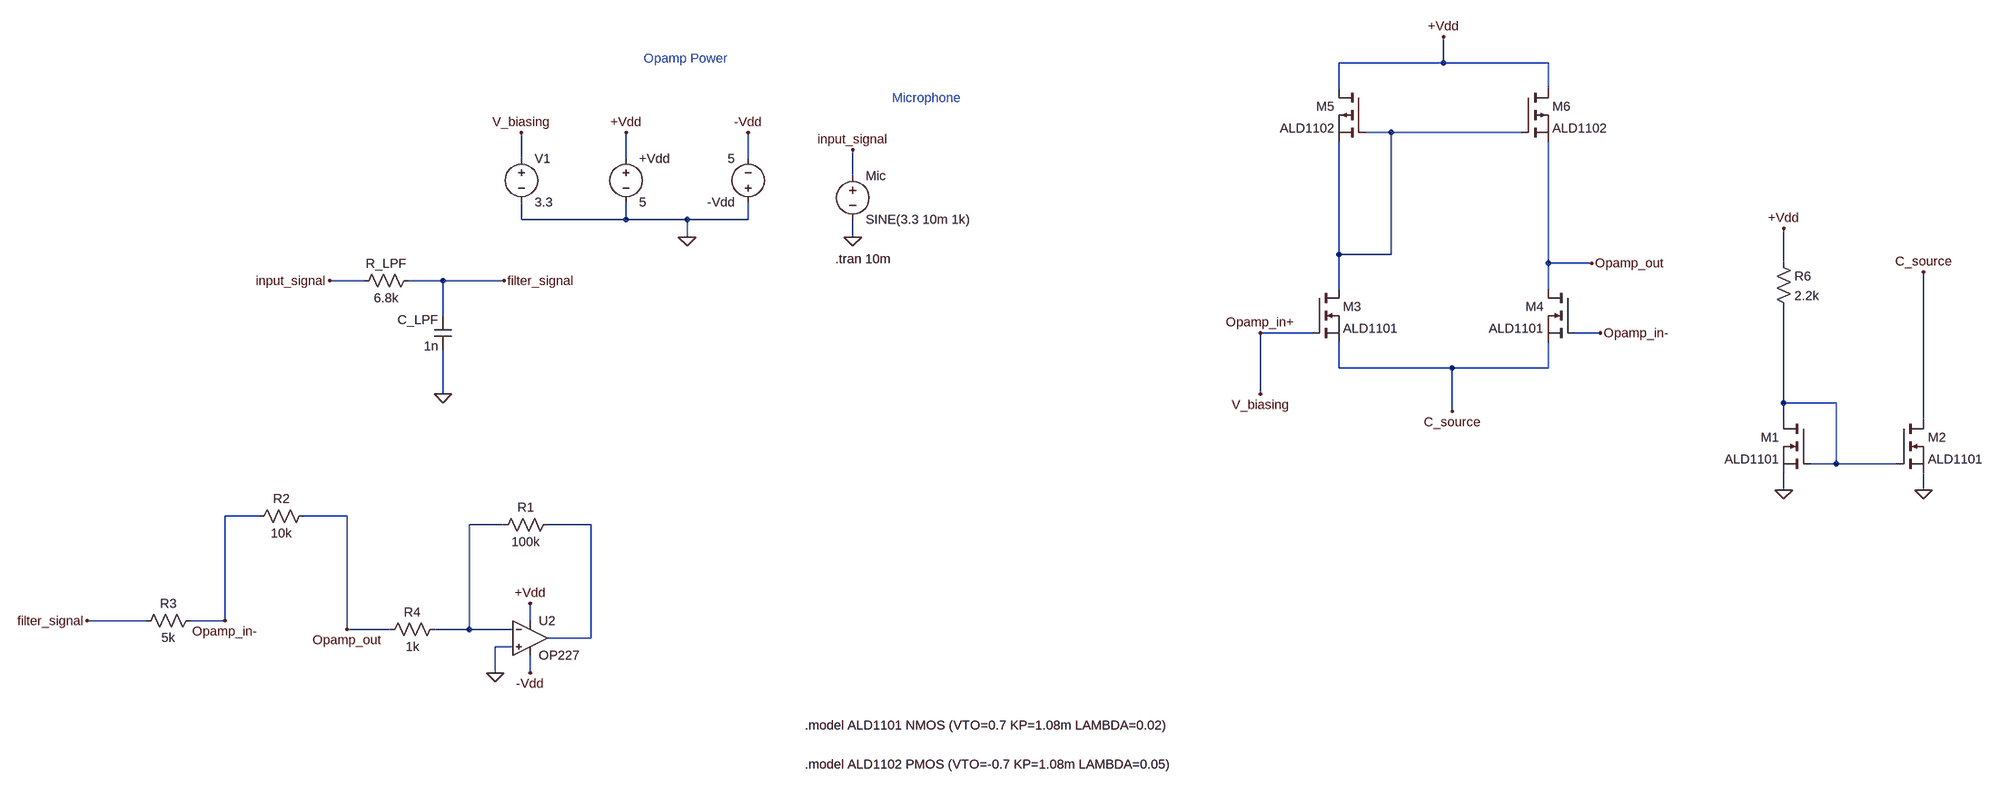
[diagram p0: schematic FinalProject_v3.asc]
FinalProject_v3.asc, the LTspice schematic file:
Version 4
SHEET 1 3940 1028
WIRE 2176 -384 2176 -432
WIRE 2176 -384 1984 -384
WIRE 2368 -384 2176 -384
WIRE 1984 -336 1984 -384
WIRE 2368 -336 2368 -384
WIRE 2080 -256 2032 -256
WIRE 2320 -256 2080 -256
WIRE 384 -208 384 -256
WIRE 576 -208 576 -256
WIRE 800 -208 800 -256
WIRE 992 -176 992 -224
WIRE 384 -96 384 -128
WIRE 576 -96 576 -128
WIRE 576 -96 384 -96
WIRE 688 -96 576 -96
WIRE 800 -96 800 -128
WIRE 800 -96 688 -96
WIRE 688 -64 688 -96
WIRE 992 -64 992 -96
WIRE 1984 -32 1984 -240
WIRE 2080 -32 2080 -256
WIRE 2080 -32 1984 -32
WIRE 2368 -16 2368 -240
WIRE 2448 -16 2368 -16
WIRE 3312 -16 3312 -80
WIRE 96 16 32 16
WIRE 240 16 176 16
WIRE 352 16 240 16
WIRE 1984 32 1984 -32
WIRE 2368 32 2368 -16
WIRE 240 80 240 16
WIRE 1936 112 1840 112
WIRE 2464 112 2416 112
WIRE 1984 176 1984 128
WIRE 2192 176 1984 176
WIRE 2368 176 2368 128
WIRE 2368 176 2192 176
WIRE 240 224 240 144
WIRE 1840 224 1840 112
WIRE 3312 240 3312 64
WIRE 3408 240 3312 240
WIRE 2192 256 2192 176
WIRE 3312 272 3312 240
WIRE 3760 272 3760 0
WIRE 3408 352 3408 240
WIRE 3408 352 3360 352
WIRE 3712 352 3408 352
WIRE 3312 400 3312 368
WIRE 3760 400 3760 368
WIRE -96 448 -160 448
WIRE 64 448 -16 448
WIRE 352 464 288 464
WIRE 512 464 432 464
WIRE -304 640 -496 640
WIRE -160 640 -160 448
WIRE -160 640 -224 640
WIRE 400 640 400 608
WIRE 64 656 64 448
WIRE 144 656 64 656
WIRE 288 656 288 464
WIRE 288 656 224 656
WIRE 368 656 288 656
WIRE 512 672 512 464
WIRE 512 672 432 672
WIRE 368 688 336 688
WIRE 336 736 336 688
WIRE 400 736 400 704
FLAG 688 -64 0
FLAG 576 -256 +Vdd
FLAG 800 -256 -Vdd
FLAG 336 736 0
FLAG 400 608 +Vdd
FLAG 400 736 -Vdd
FLAG 992 -64 0
FLAG 992 -224 input_signal
FLAG 352 16 filter_signal
FLAG 32 16 input_signal
FLAG 240 224 0
FLAG -496 640 filter_signal
FLAG 2448 -16 Opamp_out
FLAG 2464 112 Opamp_in-
FLAG 64 656 Opamp_out
FLAG -160 640 Opamp_in-
FLAG 2176 -432 +Vdd
FLAG 1840 112 Opamp_in+
FLAG 3312 -80 +Vdd
FLAG 3312 400 0
FLAG 3760 400 0
FLAG 384 -256 V_biasing
FLAG 1840 224 V_biasing
FLAG 3760 0 C_source
FLAG 2192 256 C_source
DATAFLAG 3760 144 "Id(M2)"
DATAFLAG 3312 160 "Id(M1)"
SYMBOL voltage 576 -224 R0
WINDOW 123 0 0 Left 0
WINDOW 39 0 0 Left 0
SYMATTR InstName +Vdd
SYMATTR Value 5
SYMBOL voltage 800 -112 R180
WINDOW 123 0 0 Left 0
WINDOW 39 0 0 Left 0
SYMATTR InstName -Vdd
SYMATTR Value 5
SYMBOL res 0 432 R90
WINDOW 0 0 56 VBottom 2
WINDOW 3 32 56 VTop 2
SYMATTR InstName R2
SYMATTR Value 10k
SYMBOL res -208 624 R90
WINDOW 0 0 56 VBottom 2
WINDOW 3 32 56 VTop 2
SYMATTR InstName R3
SYMATTR Value 5k
SYMBOL OpAmps\\OP227 400 608 R0
SYMATTR InstName U2
SYMBOL res 448 448 R90
WINDOW 0 0 56 VBottom 2
WINDOW 3 32 56 VTop 2
SYMATTR InstName R1
SYMATTR Value 100k
SYMBOL res 240 640 R90
WINDOW 0 0 56 VBottom 2
WINDOW 3 32 56 VTop 2
SYMATTR InstName R4
SYMATTR Value 1k
SYMBOL voltage 992 -192 R0
WINDOW 123 24 124 Left 2
WINDOW 39 0 0 Left 0
SYMATTR InstName Mic
SYMATTR Value SINE(3.3 10m 1k)
SYMBOL cap 256 144 R180
WINDOW 0 24 56 Left 2
WINDOW 3 24 8 Left 2
SYMATTR InstName C_LPF
SYMATTR Value 1n
SYMBOL res 192 0 R90
WINDOW 0 0 56 VBottom 2
WINDOW 3 32 56 VTop 2
SYMATTR InstName R_LPF
SYMATTR Value 6.8k
SYMBOL pmos 2032 -336 M0
SYMATTR InstName M5
SYMATTR Value ALD1102
SYMBOL pmos 2320 -336 R0
SYMATTR InstName M6
SYMATTR Value ALD1102
SYMBOL res 3296 -32 R0
SYMATTR InstName R6
SYMATTR Value 2.2k
SYMBOL nmos 3360 272 M0
SYMATTR InstName M1
SYMATTR Value ALD1101
SYMBOL nmos 3712 272 R0
SYMATTR InstName M2
SYMATTR Value ALD1101
SYMBOL nmos 1936 32 R0
SYMATTR InstName M3
SYMATTR Value ALD1101
SYMBOL nmos 2416 32 M0
SYMATTR InstName M4
SYMATTR Value ALD1101
SYMBOL voltage 384 -224 R0
WINDOW 123 0 0 Left 0
WINDOW 39 0 0 Left 0
SYMATTR InstName V1
SYMATTR Value 3.3
TEXT 960 -24 Left 2 !.tran 10m
TEXT 1064 -320 Left 2 ;Microphone
TEXT 608 -392 Left 2 ;Opamp Power
TEXT 904 904 Left 2 !.model ALD1102 PMOS (VTO=-0.7 KP=1.08m LAMBDA=0.05)
TEXT 904 832 Left 2 !.model ALD1101 NMOS (VTO=0.7 KP=1.08m LAMBDA=0.02)

The netlist it stands for:
* FinalProject_v3.asc
V§+Vdd +Vdd 0 5
V§-Vdd 0 -Vdd 5
R2 Opamp_out Opamp_in- 10k
R3 Opamp_in- filter_signal 5k
XU2 0 N003 +Vdd -Vdd N004 OP227  ; pins In+ In- V+ V- OUT
R1 N004 N003 100k
R4 N003 Opamp_out 1k
V§Mic input_signal 0 SINE(3.3 10m 1k)
C_LPF 0 filter_signal 1n
R_LPF filter_signal input_signal 6.8k
M5 +Vdd N001 N001 N001 ALD1102
M6 +Vdd N001 Opamp_out Opamp_out ALD1102
R6 +Vdd N002 2.2k
M1 N002 N002 0 0 ALD1101
M2 C_source N002 0 0 ALD1101
M3 N001 V_biasing C_source C_source ALD1101
M4 Opamp_out Opamp_in- C_source C_source ALD1101
V1 V_biasing 0 3.3
.model NMOS NMOS
.model PMOS PMOS
.lib standard.mos
.tran 10m
* Microphone
* Opamp Power
.model ALD1102 PMOS (VTO=-0.7 KP=1.08m LAMBDA=0.05)
.model ALD1101 NMOS (VTO=0.7 KP=1.08m LAMBDA=0.02)
.backanno
.end